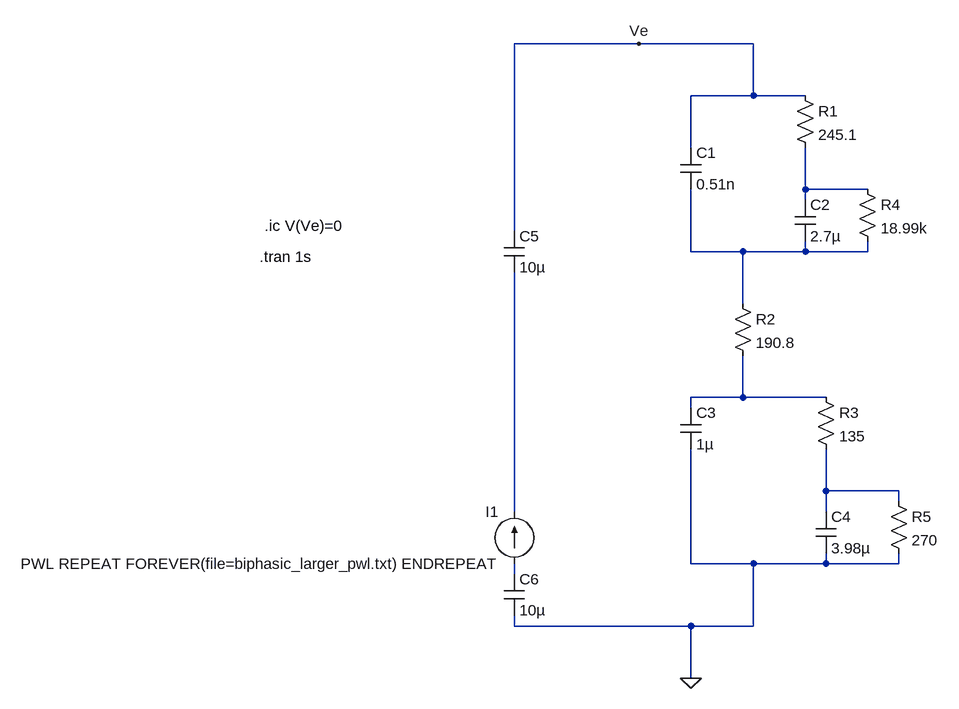
[diagram p0: schematic biphasic_triphasic_virginia_params.asc]
biphasic_triphasic_virginia_params.asc, the LTspice schematic file:
Version 4
SHEET 1 880 680
WIRE 96 -688 -96 -688
WIRE 272 -688 96 -688
WIRE 272 -608 272 -688
WIRE 272 -608 176 -608
WIRE 352 -608 272 -608
WIRE 176 -528 176 -608
WIRE 352 -464 352 -528
WIRE 448 -464 352 -464
WIRE 352 -448 352 -464
WIRE -96 -400 -96 -688
WIRE 176 -368 176 -464
WIRE 256 -368 176 -368
WIRE 352 -368 352 -384
WIRE 352 -368 256 -368
WIRE 448 -368 448 -384
WIRE 448 -368 352 -368
WIRE 256 -288 256 -368
WIRE 256 -144 256 -208
WIRE 256 -144 176 -144
WIRE 384 -144 256 -144
WIRE 176 -128 176 -144
WIRE 384 0 384 -64
WIRE 496 0 384 0
WIRE 496 16 496 0
WIRE -96 32 -96 -336
WIRE 384 32 384 0
WIRE 176 112 176 -64
WIRE 272 112 176 112
WIRE 384 112 384 96
WIRE 384 112 272 112
WIRE 496 112 496 96
WIRE 496 112 384 112
WIRE -96 128 -96 112
WIRE -96 208 -96 192
WIRE 176 208 -96 208
WIRE 272 208 272 112
WIRE 272 208 176 208
WIRE 176 288 176 208
FLAG 176 288 0
FLAG 96 -688 Ve
SYMBOL current -96 112 R180
WINDOW 0 24 80 Left 2
WINDOW 3 24 0 Left 2
SYMATTR InstName I1
SYMATTR Value PWL REPEAT FOREVER(file=biphasic_larger_pwl.txt) ENDREPEAT
SYMBOL cap 160 -528 R0
SYMATTR InstName C1
SYMATTR Value 0.51n
SYMBOL cap 336 -448 R0
SYMATTR InstName C2
SYMATTR Value 2.7µ
SYMBOL res 336 -624 R0
SYMATTR InstName R1
SYMATTR Value 245.1
SYMBOL res 240 -304 R0
SYMATTR InstName R2
SYMATTR Value 190.8
SYMBOL res 368 -160 R0
SYMATTR InstName R3
SYMATTR Value 135
SYMBOL cap 160 -128 R0
SYMATTR InstName C3
SYMATTR Value 1µ
SYMBOL cap 368 32 R0
SYMATTR InstName C4
SYMATTR Value 3.98µ
SYMBOL res 432 -480 R0
SYMATTR InstName R4
SYMATTR Value 18.99k
SYMBOL res 480 0 R0
SYMATTR InstName R5
SYMATTR Value 270
SYMBOL cap -112 -400 R0
SYMATTR InstName C5
SYMATTR Value 10µ
SYMBOL cap -112 128 R0
SYMATTR InstName C6
SYMATTR Value 10µ
TEXT -488 -360 Left 2 !.tran 1s
TEXT -480 -408 Left 2 !.ic V(Ve)=0

The netlist it stands for:
* biphasic_triphasic_virginia_params.asc
I1 N006 N005 PWL REPEAT FOREVER(file=biphasic_larger_pwl.txt) ENDREPEAT
C1 Ve N002 0.51n
C2 N001 N002 2.7µ
R1 Ve N001 245.1
R2 N002 N003 190.8
R3 N003 N004 135
C3 N003 0 1µ
C4 N004 0 3.98µ
R4 N001 N002 18.99k
R5 N004 0 270
C5 Ve N005 10µ
C6 N006 0 10µ
.tran 1s
.ic V(Ve)=0
.backanno
.end